# Altium schematic sheet Communications.SchDoc
size A; SheetNumber: 7; SheetTotal: 7
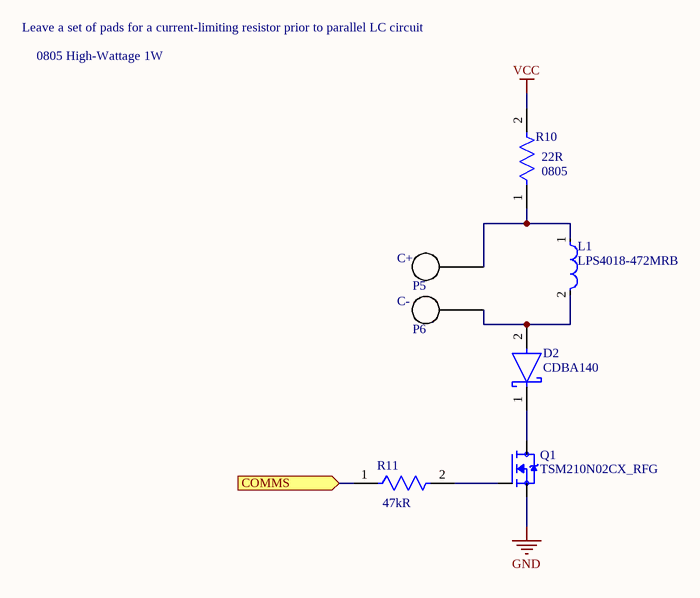
[diagram p0: Communications.SchDoc]

## Parts
D2  CDBA140  [FP-95400-MFG]
L1  LPS4018-472MRB  [FP-LPS4018-MFG]
P5  C+  [BlankPad]
P6  C-  [BlankPad]
Q1  TSM210N02CX_RFG  [TRANS_TSM210N02CX_RFG]
R10  Case/Package: 0805  Resistance: 22R  [FP-CRCW0805-e3-IPC_C]  (hidden comment: CRCW080522R0FKEA)
R11  Resistance: 47kR  [FP-CRCW0805-e3-MFG]  (hidden comment: CRCW080547K0FKEA)

## Ports
COMMS (in)

## Nets
GND: Q1.2(S)
VCC: R10.2
COMMS: R11.1 ; port COMMS
NetD2_1: D2.1(C) Q1.3(D)
NetD2_2: D2.2(A) L1.2
NetL1_1: L1.1 R10.1
NetQ1_1: Q1.1(G) R11.2

Not connected (* = marked no-connect by the designer): P5 0; P6 0

## Notes on the sheet
- Leave a set of pads for a current-limiting resistor prior to parallel LC circuit
- 0805 High-Wattage 1W

## Library data of the parts
D2 = CMP-02539-000001-1: DIODE SCHOTTKY 100V 1A SMA; Manufacturer: Vishay; Manufacturer Part Number: VS-10MQ100NTRPBF; Forward Current: 1.5A; Max Surge Forward Current: 30A; Standoff Height: 0mm; Value: 38pF; Max Junction Temp: +150°C; Peak Reverse Current: 0.1mA; Octopart: https://octopart.com/vs-10mq100ntrpbf-vishay-44340924; Max Repetitive Reverse Voltage: 100V; ComponentLink2Description: Datasheet; ComponentLink2URL: http://www.vishay.com/docs/94119/vs-10mq100ntrpbf.pdf; Reverse Voltage: 100V; Digikey Description: DIODE SCHOTTKY 100V 1A SMA; Mouser Description: DIODE SCHOTTKY 100V 1A SMA; Lead Free: Yes; Device Class L2: Diodes; Temperature Range Low: -55°C; Package: 95400; Height: 2.29mm; Capacitance: 38pF; Device Class L1: Discrete Semiconductors; Footprint Url: https://www.vishay.com/docs/95400/sma.pdf; Temperature: -55°C to +150°C; Temperature Range High: +150°C; RoHS: TRUE; Category: Diode; Device Class L3: Schottky Diodes; Automotive: No
L1 = CMP-11268-000004-1: Power inductor, shielded, 20/30% tol, SMT, RoHS, lead-free, halogen-free; Manufacturer Part Number: LPS4018-223MRB; Manufacturer: Coilcraft; Inductance: 22uH; Series Resistance: 0.36Ω; Test Frequency: 1MHz; Self Resonant Frequency: 26MHz; Tolerance: 20%; Core Material: Ferrite; Value: 22uH; Automotive Grade: Grade 3; Rms Current: 0.9A; Saturation Current: 0.8A; Shielding: true; RoHS: TRUE; Device Class L3: Fixed Inductors; Category: Ind; Lead Free: Yes; ComponentLink2URL: https://www.coilcraft.com/pdfs/lps4018.pdf; Height: 1.8mm; Mouser Description: Power inductor, shielded, 20/30% tol, SMT, RoHS, lead-free, halogen-free; Ambient Temperature Range High: +85°C; Ambient Temperature Range Low: -40°C; Device Class L2: Inductors; Package: LPS4018; Device Class L1: Passive Components; Octopart: https://octopart.com/lps4018-223mrb-coilcraft-30061092; ComponentLink2Description: Datasheet; Automotive: Yes
P5 P6 = BlankPad
Q1 = TSM210N02CX_RFG: N-Channel 20 V 6.7A (Tc) 1.56W (Tc) Surface Mount SOT-23; MF: Taiwan Semiconductor Corporation; MP: TSM210N02CX RFG; Purchase-URL: https://pricing.snapeda.com/search/part/TSM210N02CX RFG/?ref=eda; SnapEDA_Link: https://www.snapeda.com/parts/TSM210N02CX%20RFG/Taiwan+Semiconductor+Corporation/view-part/?ref=snap; Value: *; Package: SOT-23-3 Taiwan Semiconductor; Check_prices: https://www.snapeda.com/parts/TSM210N02CX%20RFG/Taiwan+Semiconductor+Corporation/view-part/?ref=eda; Price: None; Availability: In Stock
R10 = CMP-2001-03692-2: RES Thick Film, 22Ω, 1%, 0.125W, 100ppm/°C, 0805; Power Rating: 125mW; Voltage Rating: 150V; Radiation Hardening: No; Number of Terminations: 2; Termination: SMD/SMT; Package Quantity: 5000; Weight: 0.000194oz; Mount: Surface Mount; Lead Free: Lead Free; Height: 0.45mm; Composition: Thick Film; Min Operating Temperature: -55°C; Case Code (Metric): 2012; Temperature Coefficient: 100ppm/°C; Depth: 1.25mm; Packaging: Tape and Reel; Contact Plating: Tin; Width: 1.25mm; Case Code (Imperial): 0805; Length: 2mm; Max Operating Temperature: 155°C; Tolerance: 1%; Features: Automotive AEC-Q200; Military Standard: Not; Voltage Rating (DC): 150V; Max Power Dissipation: 125mW
R11 = CMP-2001-03939-2: RES Thick Film, 47kΩ, 1%, 0.125W, 100ppm/°C, 0805; Voltage Rating: 150V; Max Power Dissipation: 125mW; Termination: SMD/SMT; Case Code (Imperial): 0805; Number of Terminations: 2; Contact Plating: Tin; Min Operating Temperature: -55°C; Features: Automotive AEC-Q200; Temperature Coefficient: 100ppm/°C; Case/Package: 0805; Composition: Thick Film; Working Voltage: 150V; Width: 1.25mm; Package Quantity: 10; Lead Free: Lead Free; Radiation Hardening: No; Power Rating: 125mW; Military Standard: Not; Height: 0.45mm; Weight: 0.000194oz; Length: 2mm; Depth: 1.25mm; Voltage Rating (DC): 150V; Packaging: Tape and Reel; Case Code (Metric): 2012; Max Operating Temperature: 155°C; Tolerance: 1%